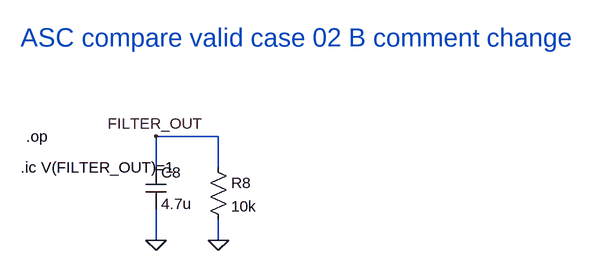
[diagram p0: schematic valid_case_02_b.asc]
valid_case_02_b.asc, the LTspice schematic file:
Version 4.1
SHEET 1 880 680
WIRE 208 64 112 64
WIRE 112 112 112 64
WIRE 208 112 208 64
WIRE 112 224 112 176
WIRE 208 224 208 192
FLAG 208 224 0
FLAG 112 224 0
FLAG 112 64 FILTER_OUT
SYMBOL cap 96 112 R0
SYMATTR InstName C8
SYMATTR Value 4.7u
SYMBOL res 192 96 R0
SYMATTR InstName R8
SYMATTR Value 10k
TEXT -96 112 Left 2 !.ic V(FILTER_OUT)=1
TEXT -88 64 Left 2 !.op
TEXT -96 -88 Left 4 ;ASC compare valid case 02 B comment change

The netlist it stands for:
* valid_case_02_b.asc
C8 FILTER_OUT 0 4.7u
R8 FILTER_OUT 0 10k
.ic V(FILTER_OUT)=1
.op
* ASC compare valid case 02 B comment change
.backanno
.end